# Altium project Line Tracker.PrjPCB
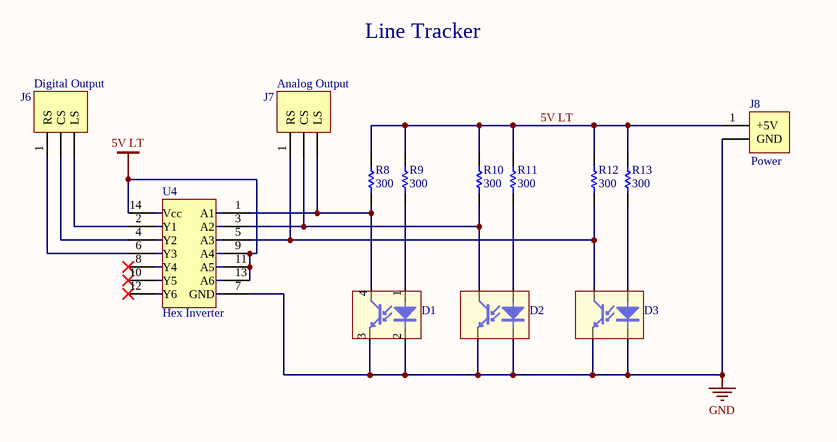
[diagram p0: Line Tracker.SchDoc]
1 sheet, 13 parts. Net scope: global (net labels, ports and power ports of the same name join across sheets).
Board file: Line-tracker.PcbDoc

## Sheet Line Tracker.SchDoc
size A

### Parts
D1  Optoisolator(custom)  [FTPNT_OPTOISOLATOR]  (value not drawn)
D2  Optoisolator(custom)  [FTPNT_OPTOISOLATOR]  (value not drawn)
D3  Optoisolator(custom)  [FTPNT_OPTOISOLATOR]  (value not drawn)
J6  Digital Output  [HDR1X3]
J7  Analog Output  [HDR1X3]
J8  Power  [HDR1X2]
R8  value 300  [FTPNT_RESISTORS]  (hidden comment: Res1)
R9  value 300  [FTPNT_RESISTORS]  (hidden comment: Res1)
R10  value 300  [FTPNT_RESISTORS]  (hidden comment: Res1)
R11  value 300  [FTPNT_RESISTORS]  (hidden comment: Res1)
R12  value 300  [FTPNT_RESISTORS]  (hidden comment: Res1)
R13  value 300  [FTPNT_RESISTORS]  (hidden comment: Res1)
U4  Hex Inverter  [FTPNT_HEXINVERTER]

### Nets
5V LT: J8.1(+5V) R8.2 R9.2 R10.2 R11.2 R12.2 R13.2 U4.9(A4) U4.11(A5) U4.13(A6) U4.14(Vcc)
GND: D1.2(K) D1.3(E) D2.2(K) D2.3(E) D3.2(K) D3.3(E) J8.2(GND) U4.7(GND)
NetD1_1: D1.1(A) R9.1
NetD1_4: D1.4(C) J7.3(LS) R8.1 U4.1(A1)
NetD2_1: D2.1(A) R11.1
NetD2_4: D2.4(C) J7.2(CS) R10.1 U4.3(A2)
NetD3_1: D3.1(A) R13.1
NetD3_4: D3.4(C) J7.1(RS) R12.1 U4.5(A3)
NetJ6_1: J6.1(RS) U4.6(Y3)
NetJ6_2: J6.2(CS) U4.4(Y2)
NetJ6_3: J6.3(LS) U4.2(Y1)

Not connected (* = marked no-connect by the designer): U4 8(Y4)* 10(Y5)* 12(Y6)*

### Notes on the sheet
- Line Tracker

### Library data of the parts
D1-D3 = Optoisolator1: SENSOR OPTO TRANS 15MM REFL PCB; Published: 24-Mar-1999; LatestRevisionDate: 04-Mar-2005; LatestRevisionNote: Sch pins 3 & 4 Swapped.; DatasheetVersion: Nov-2003; PackageDescription: DIP-4; Publisher: Altium Limited; Supplier 1: Digi-Key; Supplier Part Number 1: 751-1033-5-ND
J6 J7 = Header 3: CONN HEADER VERT 3POS .100 TIN; LatestRevisionDate: 17-Jul-2002; LatestRevisionNote: Re-released for DXP Platform.; Publisher: Altium Limited; Supplier 1: Digi-Key; Supplier Part Number 1: A19470-ND; PackageDescription: SIP-3
J8 = Header 2: CONN HEADER VERT 2POS .100 TIN; LatestRevisionDate: 17-Jul-2002; LatestRevisionNote: Re-released for DXP Platform.; Publisher: Altium Limited; Supplier 1: Digi-Key; Supplier Part Number 1: A1921-ND; PackageDescription: SIP-2
R8-R13 = Res1: RES 300 OHM 1/4W 1% 1206 SMD; Published: 8-Jun-2000; LatestRevisionDate: 17-Jul-2002; LatestRevisionNote: Re-released for DXP Platform.; PackageReference: AXIAL-0.3; Publisher: Altium Limited; PackageDescription: 1206; Supplier 1: Digi-Key; Supplier Part Number 1: 311-300FRCT-ND
U4 = Header 7X2A: IC TRIGGER HEX INVERT 14-SOIC; LatestRevisionDate: 17-Jul-2002; LatestRevisionNote: Re-released for DXP Platform.; Publisher: Altium Limited; Supplier 1: Digi-Key; Supplier Part Number 1: MM74HC14M-ND; PackageDescription: 14-SOIC